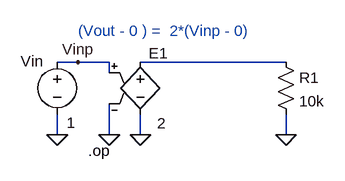
[diagram p0: schematic op_dir_dep_sim.asc]
op_dir_dep_sim.asc, the LTspice schematic file:
Version 4
SHEET 1 880 680
WIRE 48 96 16 96
WIRE 96 96 48 96
WIRE 368 96 144 96
WIRE 96 112 96 96
WIRE 16 208 16 176
WIRE 96 208 96 160
WIRE 144 208 144 176
WIRE 368 208 368 176
FLAG 48 96 Vinp
FLAG 16 208 0
FLAG 96 208 0
FLAG 144 208 0
FLAG 368 208 0
SYMBOL e 144 80 R0
WINDOW 0 13 2 Left 2
WINDOW 3 26 110 Left 2
SYMATTR InstName E1
SYMATTR Value 2
SYMBOL res 352 80 R0
SYMATTR InstName R1
SYMATTR Value 10k
SYMBOL voltage 16 80 R0
WINDOW 0 -56 15 Left 2
WINDOW 3 15 109 Left 2
SYMATTR InstName Vin
SYMATTR Value 1
TEXT 48 48 Left 2 ;(Vout - 0 ) =  2*(Vinp - 0)
TEXT 64 232 Left 2 !.op

The netlist it stands for:
* op_dir_dep_sim.asc
E1 N001 0 Vinp 0 2
R1 N001 0 10k
Vin Vinp 0 1
* (Vout - 0 ) =  2*(Vinp - 0)
.op
.backanno
.end